# EAGLE design PartsHunter (EAGLE 9.5.2)
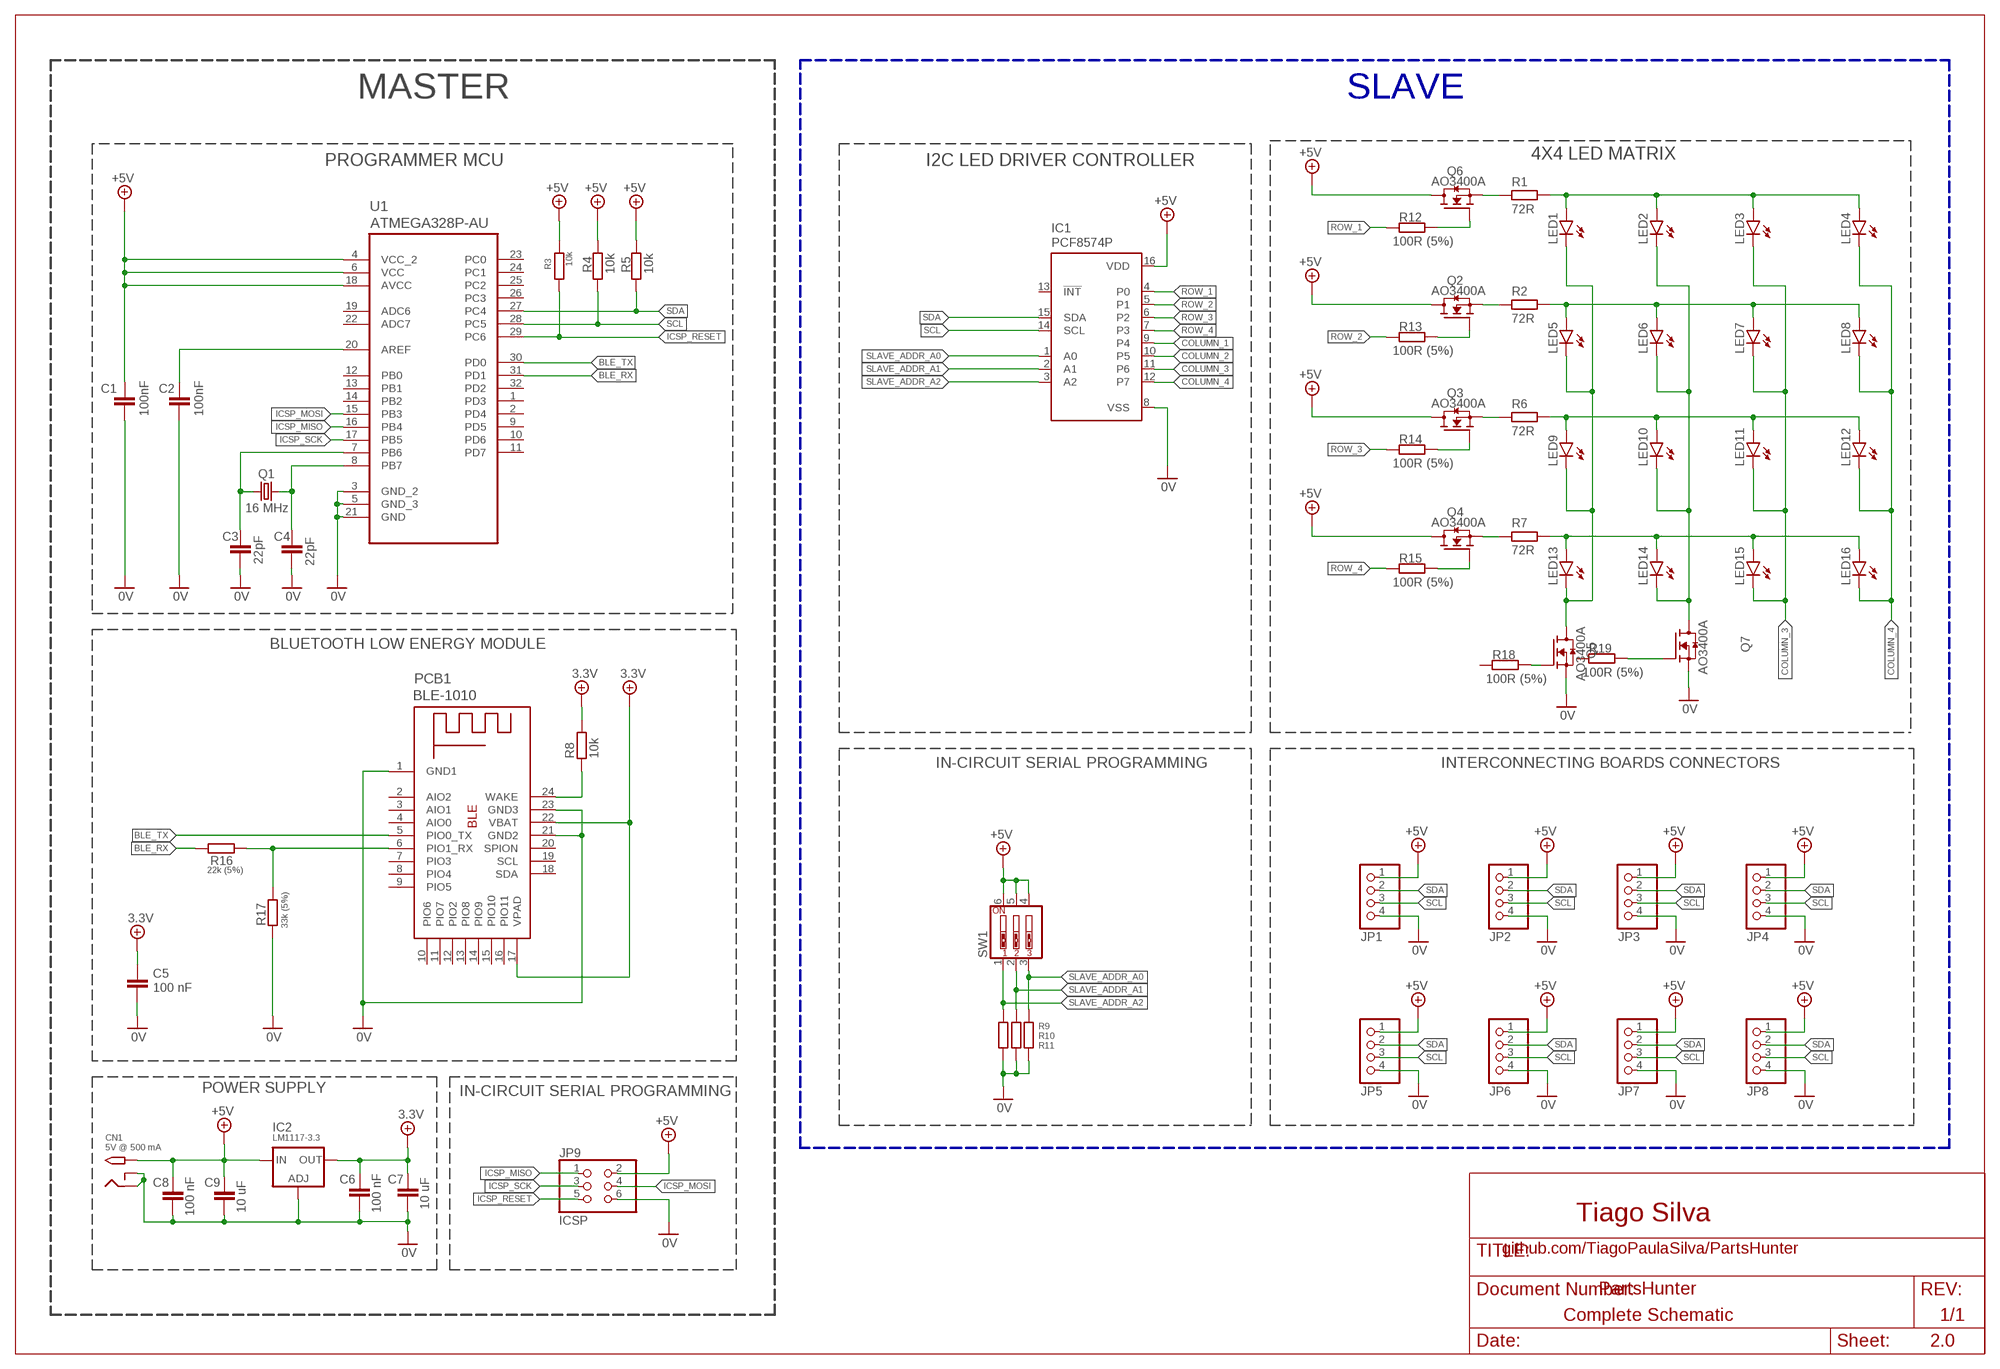
[diagram p0: schematic, sheet 1]

## Parts
C1  100nF  C-EUC0805  [C0805]
C2  100nF  C-EUC0805  [C0805]
C3  22pF  C-EUC0805  [C0805]
C4  22pF  C-EUC0805  [C0805]
C5  100 nF  C-EUC0805  [C0805]
C6  100 nF  C-EUC0805  [C0805]
C7  10 uF  C-EUC0805  [C0805]
C8  100 nF  C-EUC0805  [C0805]
C9  10 uF  C-EUC0805  [C0805]
CN1  2.1MMJACKTHM  [PJ-102A]
IC1  PCF8574P  [DIL16]
IC2  LM1117-3.3  LD117AS33TR  [SOT223]
JP1  PINHD-1X4/90  [1X04/90]
JP2  PINHD-1X4/90  [1X04/90]
JP3  PINHD-1X4/90  [1X04/90]
JP4  PINHD-1X4/90  [1X04/90]
JP5  PINHD-1X4/90  [1X04/90]
JP6  PINHD-1X4/90  [1X04/90]
JP7  PINHD-1X4/90  [1X04/90]
JP8  PINHD-1X4/90  [1X04/90]
JP9  ICSP  PINHD-2X3  [2X03]
LED1  LEDKA-3528ASYC  [KA-3528ASYC]
LED2  LEDKA-3528ASYC  [KA-3528ASYC]
LED3  LEDKA-3528ASYC  [KA-3528ASYC]
LED4  LEDKA-3528ASYC  [KA-3528ASYC]
LED5  LEDKA-3528ASYC  [KA-3528ASYC]
LED6  LEDKA-3528ASYC  [KA-3528ASYC]
LED7  LEDKA-3528ASYC  [KA-3528ASYC]
LED8  LEDKA-3528ASYC  [KA-3528ASYC]
LED9  LEDKA-3528ASYC  [KA-3528ASYC]
LED10  LEDKA-3528ASYC  [KA-3528ASYC]
LED11  LEDKA-3528ASYC  [KA-3528ASYC]
LED12  LEDKA-3528ASYC  [KA-3528ASYC]
LED13  LEDKA-3528ASYC  [KA-3528ASYC]
LED14  LEDKA-3528ASYC  [KA-3528ASYC]
LED15  LEDKA-3528ASYC  [KA-3528ASYC]
LED16  LEDKA-3528ASYC  [KA-3528ASYC]
PCB1  BLE-1010  [BLE-1010]
Q1  16 MHz  CRYSTALHC49UP  [HC49UP]
Q2  AO3400A  [SOT95P280X125-3N]
Q3  AO3400A  [SOT95P280X125-3N]
Q4  AO3400A  [SOT95P280X125-3N]
Q5  AO3400A  [SOT95P280X125-3N]
Q6  AO3400A  [SOT95P280X125-3N]
Q7  AO3400A  [SOT95P280X125-3N]
R1  72R  R-EU_R0805  [R0805]
R2  72R  R-EU_R0805  [R0805]
R3  10k  R-EU_R0805  [R0805]
R4  10k  R-EU_R0805  [R0805]
R5  10k  R-EU_R0805  [R0805]
R6  72R  R-EU_R0805  [R0805]
R7  72R  R-EU_R0805  [R0805]
R8  10k  R-EU_R0603  [R0603]
R9  10k  R-EU_R0805  [R0805]
R10  10k  R-EU_R0805  [R0805]
R11  10k  R-EU_R0805  [R0805]
R12  100R (5%)  R-EU_R0805  [R0805]
R13  100R (5%)  R-EU_R0805  [R0805]
R14  100R (5%)  R-EU_R0805  [R0805]
R15  100R (5%)  R-EU_R0805  [R0805]
R16  22k (5%)  R-EU_R0805  [R0805]
R17  33k (5%)  R-EU_R0805  [R0805]
R18  100R (5%)  R-EU_R0805  [R0805]
R19  100R (5%)  R-EU_R0805  [R0805]
SW1  SW_DIP-3  [EDG-03]
U1  ATMEGA328P-AU  [QFP80P900X900X120-32N]

## Nets
0V: C1.1 C2.1 C3.1 C4.1 C5.2 C6.2 C7.2 C8.2 C9.2 CN1.RING CN1.RING_SW IC1.8(VSS) IC2.1(ADJ) JP1.4 JP2.4 JP3.4 JP4.4 JP5.4 JP6.4 JP7.4 JP8.4 JP9.6 PCB1.1(GND1) PCB1.21(GND2) PCB1.23(GND3) Q5.2(S) Q7.2(S) R9.2 R10.2 R11.2 R17.1 U1.3(GND_2) U1.5(GND_3) U1.21(GND)
3.3V: C5.1 C6.1 C7.1 IC2.4(OUT) PCB1.17(VPAD) PCB1.22(VBAT) R8.1
+5V: C1.2 C8.1 C9.1 CN1.TIP IC1.16(VDD) IC2.3(IN) JP1.1 JP2.1 JP3.1 JP4.1 JP5.1 JP6.1 JP7.1 JP8.1 JP9.2 Q2.3(D) Q3.3(D) Q4.3(D) Q6.3(D) R3.1 R4.1 R5.1 SW1.4 SW1.5 SW1.6 U1.4(VCC_2) U1.6(VCC) U1.18(AVCC)
BLE_RX: R16.1 U1.31(PD1)
BLE_TX: PCB1.5(PIO0_TX) U1.30(PD0)
BLE_WAKE: PCB1.24(WAKE) R8.2
COLUMN_1: IC1.9(P4) LED1.C LED1.P$2(C) LED5.C LED5.P$2(C) LED9.C LED9.P$2(C) LED13.C LED13.P$2(C) Q5.3(D)
COLUMN_2: IC1.10(P5) LED2.C LED2.P$2(C) LED6.C LED6.P$2(C) LED10.C LED10.P$2(C) LED14.C LED14.P$2(C) Q7.3(D)
COLUMN_3: IC1.11(P6) LED3.C LED3.P$2(C) LED7.C LED7.P$2(C) LED11.C LED11.P$2(C) LED15.C LED15.P$2(C)
COLUMN_4: IC1.12(P7) LED4.C LED4.P$2(C) LED8.C LED8.P$2(C) LED12.C LED12.P$2(C) LED16.C LED16.P$2(C)
ICSP_MISO: JP9.1 U1.16(PB4)
ICSP_MOSI: JP9.4 U1.15(PB3)
ICSP_RESET: JP9.5 R3.2 U1.29(PC6)
ICSP_SCK: JP9.3 U1.17(PB5)
N$1: C3.2 Q1.1 U1.7(PB6)
N$2: C4.2 Q1.2 U1.8(PB7)
N$3: Q6.1(G) R12.2
N$4: Q6.2(S) R1.2
N$5: LED1.A LED1.P$1(A) LED2.A LED2.P$1(A) LED3.A LED3.P$1(A) LED4.A LED4.P$1(A) R1.1
N$6: LED5.A LED5.P$1(A) LED6.A LED6.P$1(A) LED7.A LED7.P$1(A) LED8.A LED8.P$1(A) R2.1
N$7: LED9.A LED9.P$1(A) LED10.A LED10.P$1(A) LED11.A LED11.P$1(A) LED12.A LED12.P$1(A) R6.1
N$8: LED13.A LED13.P$1(A) LED14.A LED14.P$1(A) LED15.A LED15.P$1(A) LED16.A LED16.P$1(A) R7.1
N$9: Q4.1(G) R15.2
N$10: Q2.2(S) R2.2
N$11: Q3.1(G) R14.2
N$12: Q3.2(S) R6.2
N$13: Q2.1(G) R13.2
N$14: Q4.2(S) R7.2
N$15: PCB1.6(PIO1_RX) R16.2 R17.2
N$16: Q5.1(G) R18.2
N$17: C2.2 U1.20(AREF)
N$18: Q7.1(G) R19.2
ROW_1: IC1.4(P0) R12.1
ROW_2: IC1.5(P1) R13.1
ROW_3: IC1.6(P2) R14.1
ROW_4: IC1.7(P3) R15.1
SCL: IC1.14(SCL) JP1.3 JP2.3 JP3.3 JP4.3 JP5.3 JP6.3 JP7.3 JP8.3 R4.2 U1.28(PC5)
SDA: IC1.15(SDA) JP1.2 JP2.2 JP3.2 JP4.2 JP5.2 JP6.2 JP7.2 JP8.2 R5.2 U1.27(PC4)
SLAVE_ADDR_A0: IC1.1(A0) R11.1 SW1.3
SLAVE_ADDR_A1: IC1.2(A1) R10.1 SW1.2
SLAVE_ADDR_A2: IC1.3(A2) R9.1 SW1.1
Unconnected: IC1.13(!INT) PCB1.2(AIO2) PCB1.3(AIO1) PCB1.4(AIO0) PCB1.7(PIO3) PCB1.8(PIO4) PCB1.9(PIO5) PCB1.10(PIO6) PCB1.11(PIO7) PCB1.12(PIO2) PCB1.13(PIO8) PCB1.14(PIO9) PCB1.15(PIO10) PCB1.16(PIO11) PCB1.18(SDA) PCB1.19(SCL) PCB1.20(SPION) R18.1 R19.1 U1.1(PD3) U1.2(PD4) U1.9(PD5) U1.10(PD6) U1.11(PD7) U1.12(PB0) U1.13(PB1) U1.14(PB2) U1.19(ADC6) U1.22(ADC7) U1.23(PC0) U1.24(PC1) U1.25(PC2) U1.26(PC3) U1.32(PD2)

## Notes on the sheet
- MASTER | SLAVE
- PROGRAMMER MCU | 4X4 LED MATRIX
- I2C LED DRIVER CONTROLLER
- BLUETOOTH LOW ENERGY MODULE
- IN-CIRCUIT SERIAL PROGRAMMING | INTERCONNECTING BOARDS CONNECTORS
- POWER SUPPLY | IN-CIRCUIT SERIAL PROGRAMMING
- 5V @ 500 mA
- Tiago Silva
- github.com/TiagoPaulaSilva/PartsHunter
- Complete Schematic
- 2.0

## Library data of the parts
C1-C9 = rcl:C-EU: CAPACITOR, European symbol; SPICEPREFIX: C
CN1 = adafruit:2.1MMJACK: 2.1mm x 5.5mm THM DC jack with internal switch. Digikey part #PJ-102A, 4UCON part #05537 2.1mm x 5.5mm SMT DC jack with internal switch. Digikey part #PJ-002A-SMT, 4UCON part #03267 By microbuilder.eu & adafruit.com
IC1 = micro-philips:PCF8574: I2C-Bus Remote 8-bit I/O expander http://www.semiconductors.philips.com/acrobat_download/datasheets/PCF8574_4.pdf; MPN: PCF8574PN; OC_FARNELL: 204020; OC_NEWARK: 11N8515
IC2 = v-reg:LD117A?*: Low drop fixed and adjustable positive voltage regulators 1 A Source: http://www.st.com/stonline/products/literature/ds/7194/ld1117axx.pdf
JP1-JP8 = pinhead:PINHD-1X4: PIN HEADER
JP9 = pinhead:PINHD-2X3: PIN HEADER
LED1-LED16 = led2:LED: LED OSRAM: - CHIPLED LG R971, LG N971, LY N971, LG Q971, LY Q971, LO R971, LY R971 LH N974, LH R974 LS Q976, LO Q976, LY Q976 LO Q996 - Hyper CHIPLED LW Q18S LB Q993, LB Q99A, LB R99A - SideLED LS A670, LO A670, LY A670, LG A670, LP A670 LB A673, LV A673, LT A673, LW A673 LH A674 LY A675 LS A676, LA A676, LO A676, LY A676, LW A676 LS A679, LY A679, LG A679 - Hyper Micro SIDELED® LS Y876, LA Y876, LO Y876, LY Y876 LT Y87S - SmartLED LW L88C, LW L88S LB L89C, LB L89S, LG L890 LS L89K, LO L89K, LY L89K LS L896, LA L896, LO L896, LY L896 - TOPLED LS T670, LO T670, LY T670, LG T670, LP T670 LSG T670, LSP T670, LSY T670, LOP T670, LYG T670 LG T671, LOG T671, LSG T671 LB T673, LV T673, LT T673, LW T673 LH T674 LS T676, LA T676, LO T676, LY T676, LB T676, LH T676, LSB T676, LW T676 LB T67C, LV T67C, LT T67C, LS T67K, LO T67K, LY T67K, LW E67C LS E67B, LA E67B, LO E67B, LY E67B, LB E67C, LV E67C, LT E67C LW T67C LS T679, LY T679, LG T679 LS T770, LO T770, LY T770, LG T770, LP T770 LB T773, LV T773, LT T773, LW T773 LH T774 LS E675, LA E675, LY E675, LS T675 LS T776, LA T776, LO T776, LY T776, LB T776 LHGB T686 LT T68C, LB T68C - Hyper Mini TOPLED® LB M676 - Mini TOPLED Santana® LG M470 LS M47K, LO M47K, LY M47K Source: http://www.osram.convergy.de LUXEON: - LUMILED® LXK2-PW12-R00, LXK2-PW12-S00, LXK2-PW14-U00, LXK2-PW14-V00 LXK2-PM12-R00, LXK2-PM12-S00, LXK2-PM14-U00 LXK2-PE12-Q00, LXK2-PE12-R00, LXK2-PE12-S00, LXK2-PE14-T00, LXK2-PE14-U00 LXK2-PB12-K00, LXK2-PB12-L00, LXK2-PB12-M00, LXK2-PB14-N00, LXK2-PB14-P00, LXK2-PB14-Q00 LXK2-PR12-L00, LXK2-PR12-M00, LXK2-PR14-Q00, LXK2-PR14-R00 LXK2-PD12-Q00, LXK2-PD12-R00, LXK2-PD12-S00 LXK2-PH12-R00, LXK2-PH12-S00 LXK2-PL12-P00, LXK2-PL12-Q00, LXK2-PL12-R00 Source: www.luxeon.com KINGBRIGHT: KA-3528ASYC Source: www.kingbright.com
PCB1 = BLE-1010:BLE-1010
Q1 = crystal:CRYSTAL: CRYSTAL; OC_FARNELL: unknown; OC_NEWARK: unknown
Q2-Q7 = AO3400A:AO3400A: Trans MOSFET N-CH 30V 5.7A 3-Pin SOT-23; AVAILABILITY: Unavailable; DESCRIPTION: N-Channel 30V 5.7A _Ta_ 1.4W _Ta_ Surface Mount SOT-23-3L; MF: Alpha &; MP: AO3400A; PACKAGE: SOT-23 Alpha &amp; Omega Semiconductor; PRICE: None
R1-R19 = rcl:R-EU_: RESISTOR, European symbol; SPICEPREFIX: R
SW1 = special:SW_DIP-3: DIP SWITCH
U1 = Atmel_By_element14_Batch_1-00:ATMEGA328P-AU: 8-bit Microcontroller with In-System Programmable Flash; MPN: ATMEGA328P-AU; OC_FARNELL: 1715486; OC_NEWARK: 14R4631; PACKAGE: TQFP-32; SUPPLIER: Atmel

## Net classes
2 gnd: width 0.152 mm, drill 0.559 mm, clearance 0.254 mm

## Board
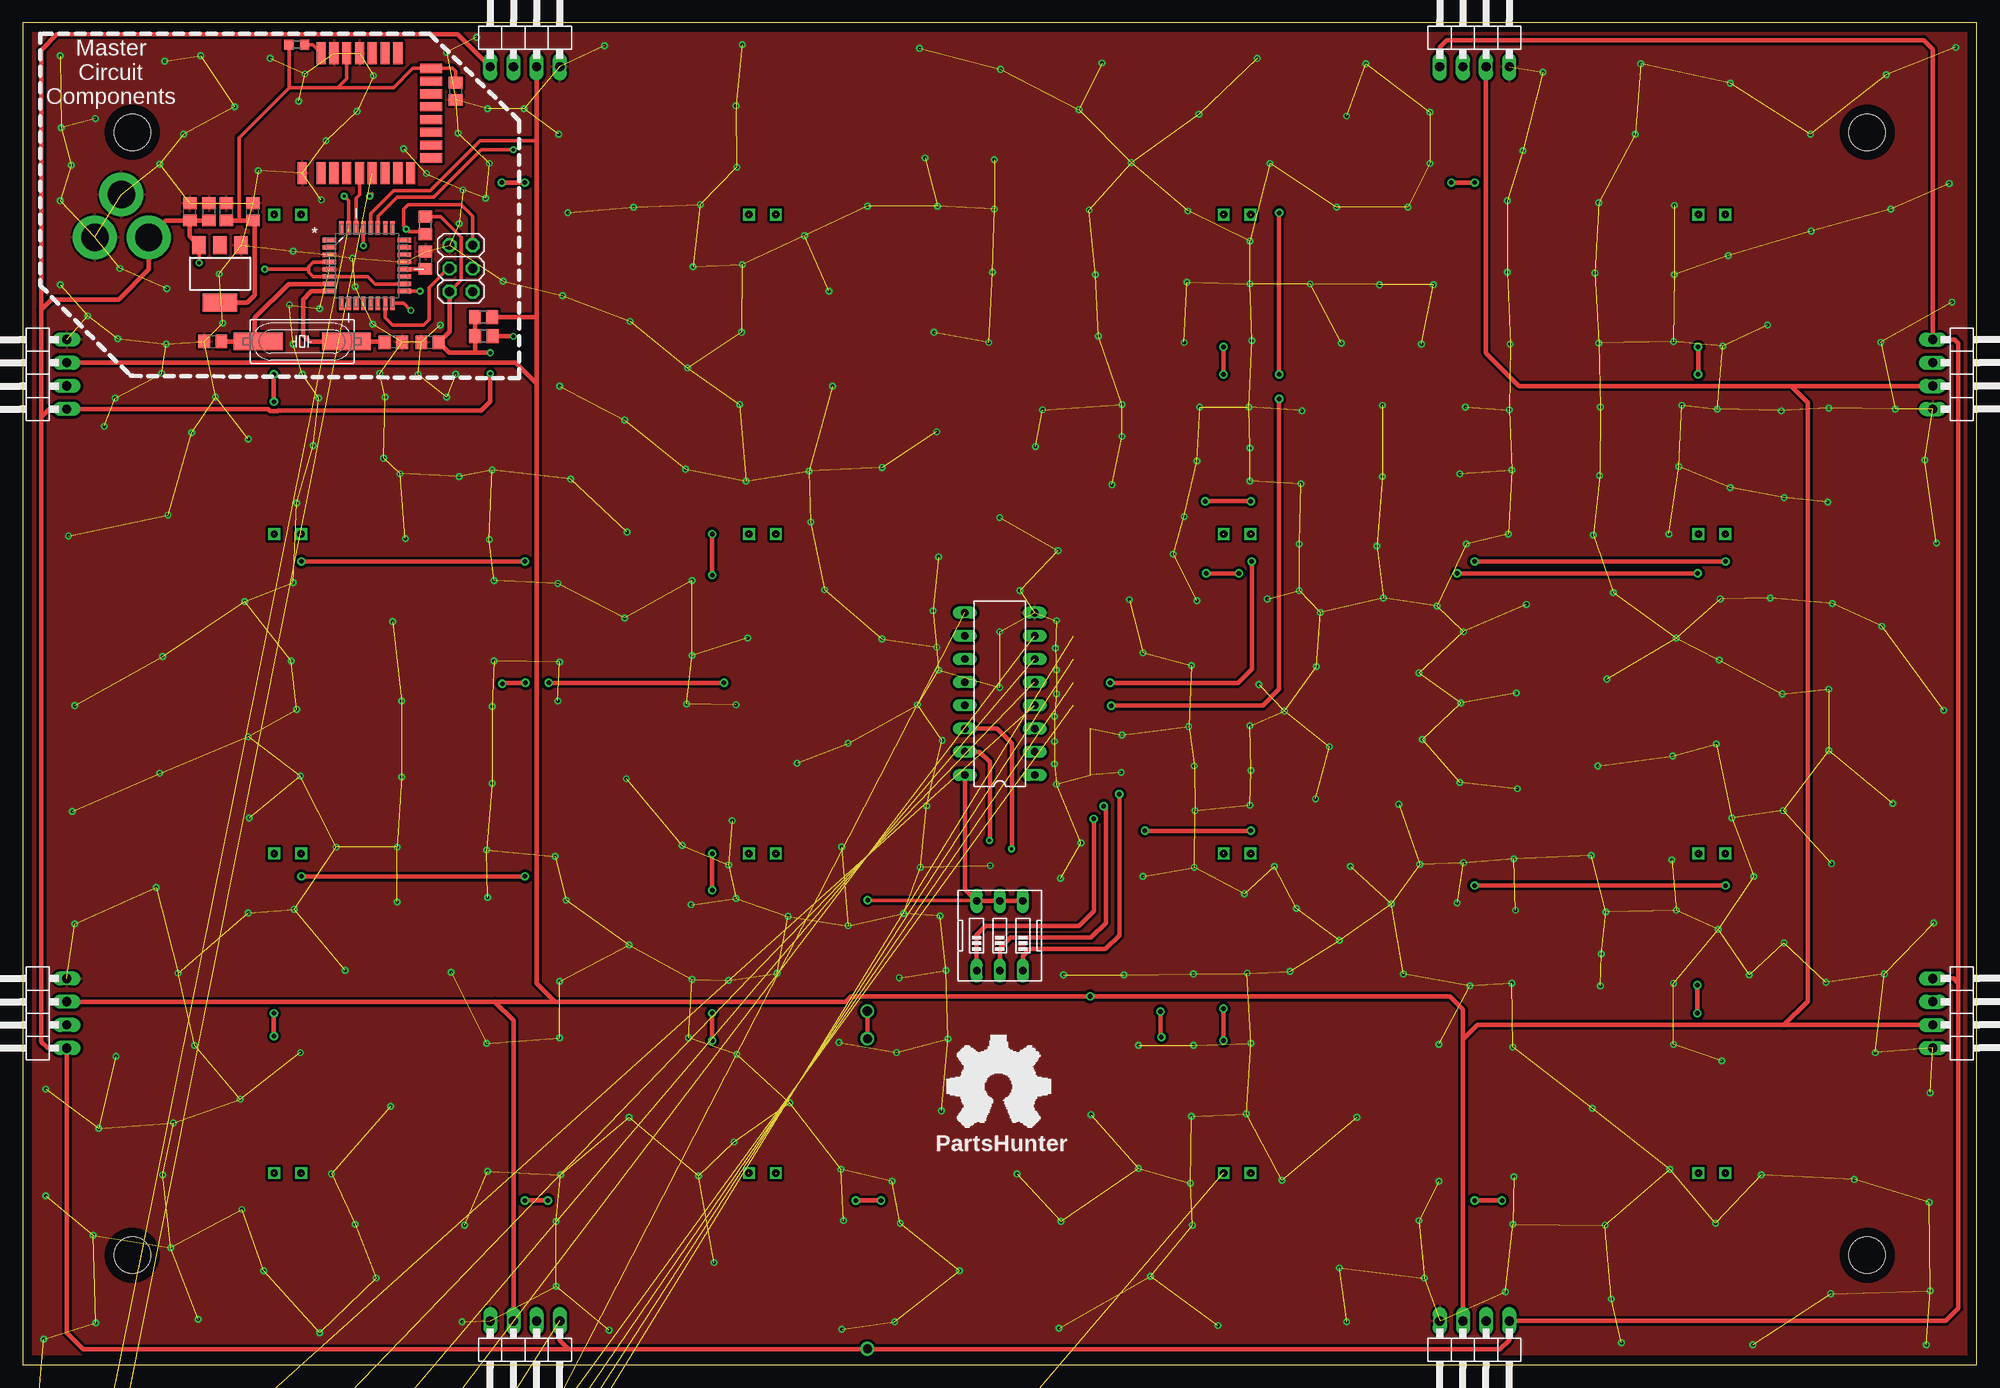
[diagram p1: board, top side]
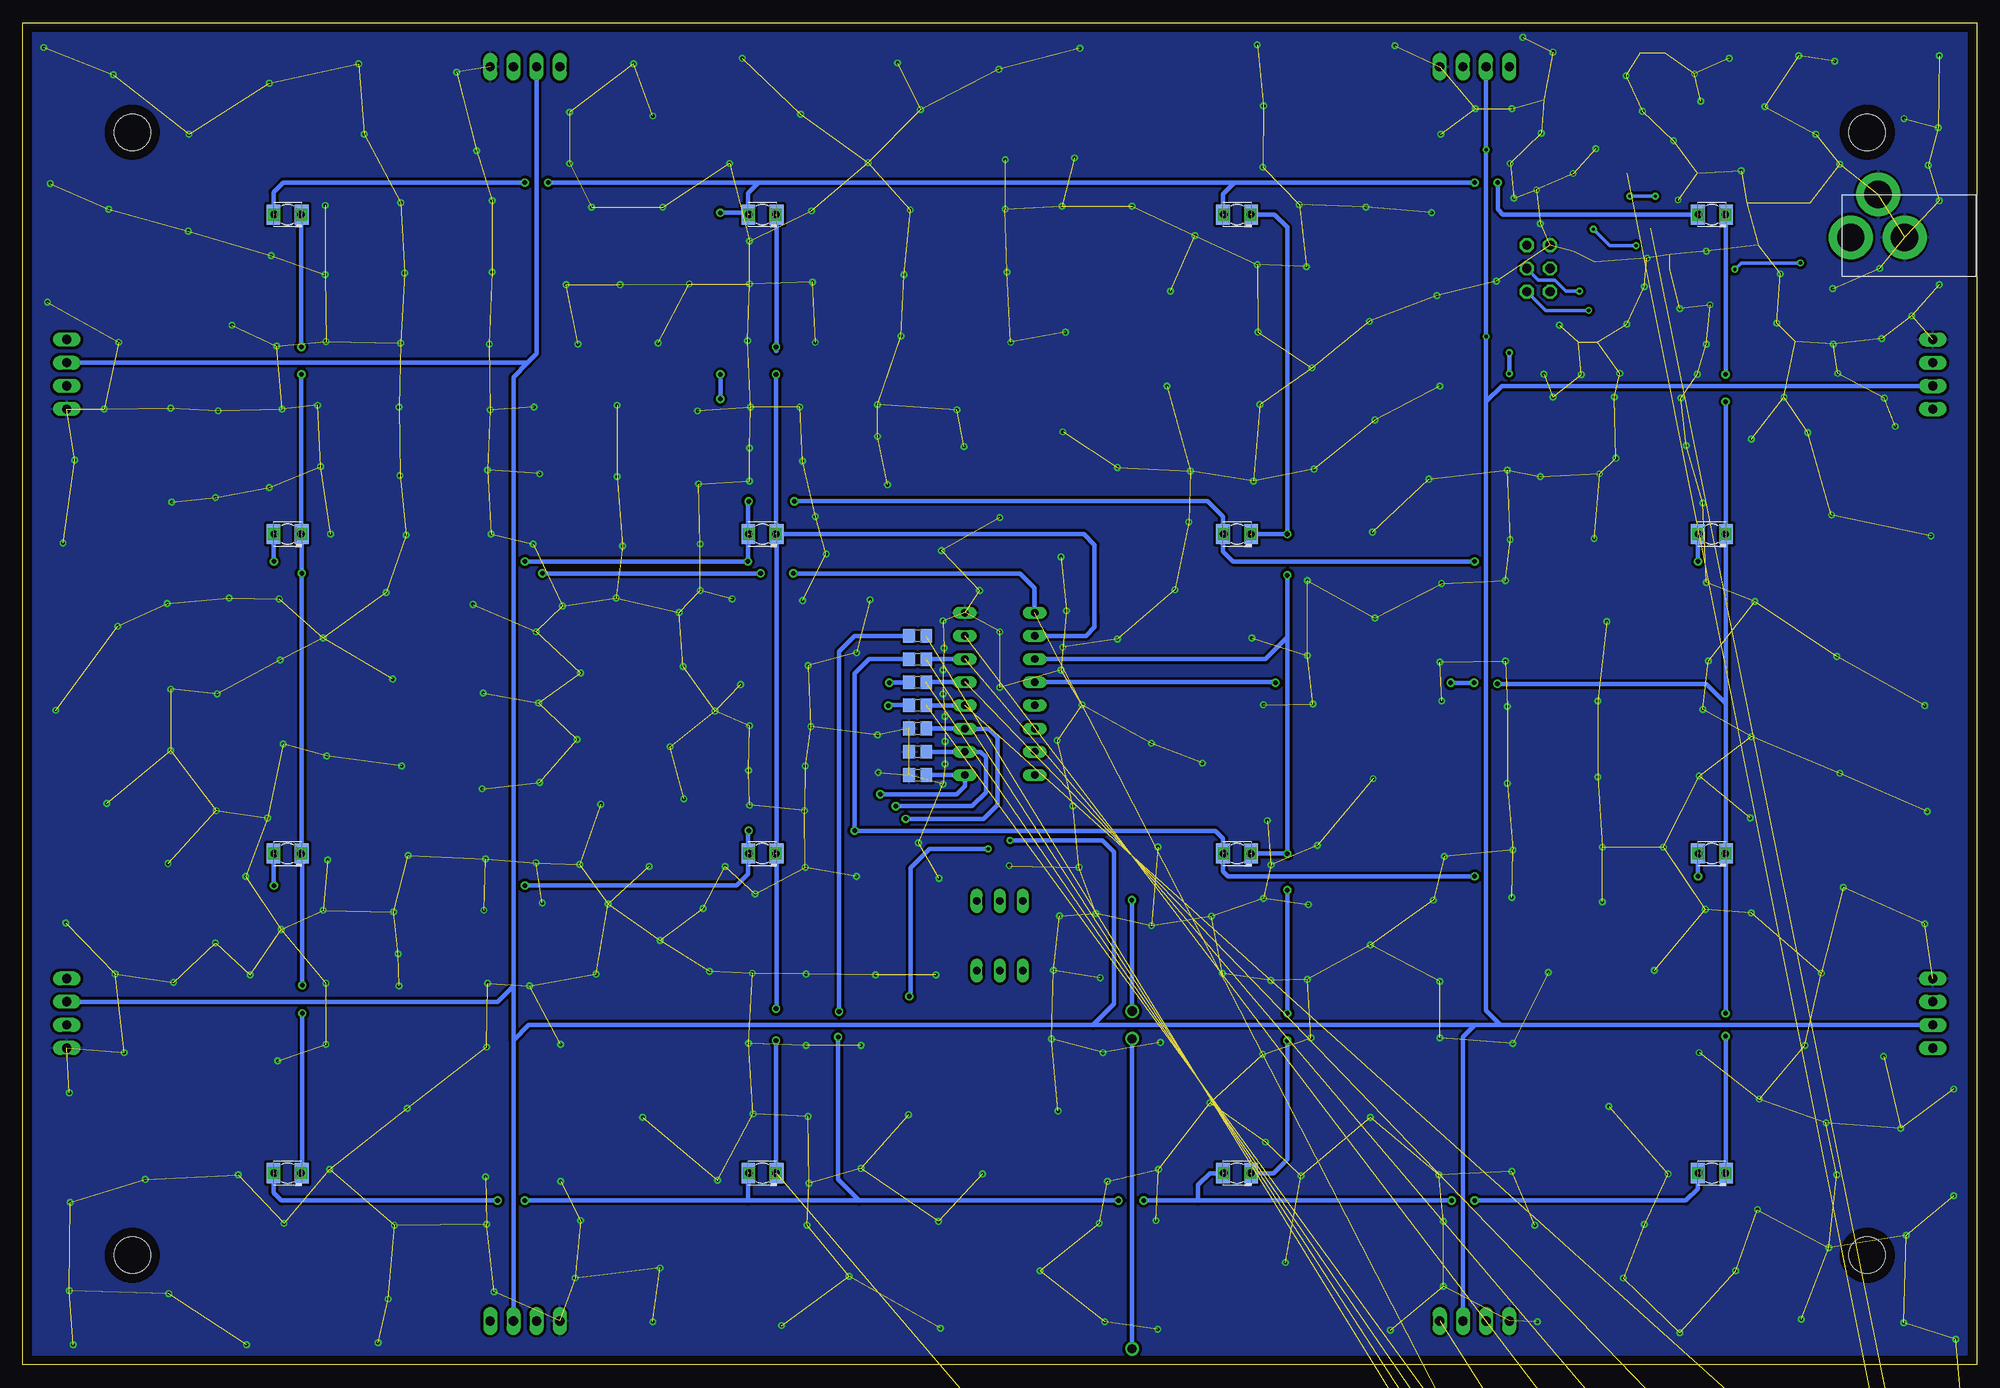
[diagram p2: board, bottom side, seen from below]

Size 214 x 147 mm. Coordinates in mm from the lower left corner, seen from the top.
Outline: 0,0 214,0 214,147 0,147 0,0
Copper layers (1*16): Top 0.035mm / dielectric 1.5mm / Bottom 0.035mm
Design rules "default *": minimum track width 15mil, minimum drill 0.35mm, track to track 12mil, track to pad 12mil, pad to pad 12mil, via to via 12mil, smd to smd 12mil, copper to edge 40mil, drill to drill 6mil, minimum pad ring 10mil, minimum via ring 8mil, stop-mask expansion 4mil, vias tented up to drill 0mil, thermal gap 10mil
Holes 4 mm at 12,135 202,135 12,12 202,12

### Footprints (pad centres in the part's own frame; a part is rotated, then mirrored left to right if it is on the bottom)
C0805 = smd 1.3 x 1.5: 1 -0.95,0; 2 0.95,0
PJ-102A = drill 3 pad 4.8: RING 0.1,-3.39; RING_SW -4.6,-6.29; TIP 0.1,-9.29
DIL16 = drill 0.813 long: 1 -8.89,-3.81; 2 -6.35,-3.81; 3 -3.81,-3.81; 4 -1.27,-3.81; 5 1.27,-3.81; 6 3.81,-3.81; 7 6.35,-3.81; 8 8.89,-3.81; 9 8.89,3.81; 10 6.35,3.81; 11 3.81,3.81; 12 1.27,3.81; 13 -1.27,3.81; 14 -3.81,3.81; 15 -6.35,3.81; 16 -8.89,3.81
SOT223 = smd 1.5 x 2: 1 -2.3,-3.15; 2 0,-3.15; 3 2.3,-3.15 | smd 3.8 x 2: 4 0,3.15
1X04/90 = drill 1.016 long: 1 -3.81,-3.81; 2 -1.27,-3.81; 3 1.27,-3.81; 4 3.81,-3.81
2X03 = drill 1.016 octagon: 1 -2.54,-1.27; 2 -2.54,1.27; 3 0,-1.27; 4 0,1.27; 5 2.54,-1.27; 6 2.54,1.27
KA-3528ASYC = smd 1.5 x 2.2: A -1.55,0; C 1.55,0 | drill 0.8 square: P$1 -1.47,0; P$2 1.47,0
BLE-1010 = smd 2.41 x 1: 1 -6.75,6.02; 2 -6.75,3.92; 3 -6.75,2.52; 4 -6.75,1.12; 5 -6.75,-0.28; 6 -6.75,-1.68; 7 -6.75,-3.08; 8 -6.75,-4.48; 9 -6.75,-5.88; 18 6.35,-4.48; 19 6.35,-3.08; 20 6.35,-1.68; 21 6.35,-0.28; 22 6.35,1.12; 23 6.35,2.52; 24 6.35,3.92 | smd 1 x 2.41: 10 -5.1,-8.1; 11 -3.7,-8.1; 12 -2.3,-8.1; 13 -0.9,-8.1; 14 0.5,-8.1; 15 1.9,-8.1; 16 3.3,-8.1; 17 4.7,-8.1
HC49UP = smd 5.334 x 1.93: 1 -4.826,0; 2 4.826,0
SOT95P280X125-3N = smd 1.21 x 0.59: 1 -1.255,0.95; 2 -1.255,-0.95; 3 1.255,0
R0805 = smd 1.3 x 1.5: 1 -0.95,0; 2 0.95,0
R0603 = smd 1 x 1.1: 1 -0.85,0; 2 0.85,0
EDG-03 = drill 0.813 long: 1 -2.54,-3.81; 2 0,-3.81; 3 2.54,-3.81; 4 2.54,3.81; 5 0,3.81; 6 -2.54,3.81
QFP80P900X900X120-32N = smd 1.473 x 0.508: 1 -4.115,2.794; 2 -4.115,2.007; 3 -4.115,1.194; 4 -4.115,0.406; 5 -4.115,-0.406; 6 -4.115,-1.194; 7 -4.115,-2.007; 8 -4.115,-2.794; 17 4.115,-2.794; 18 4.115,-2.007; 19 4.115,-1.194; 20 4.115,-0.406; 21 4.115,0.406; 22 4.115,1.194; 23 4.115,2.007; 24 4.115,2.794 | smd 0.508 x 1.473: 9 -2.794,-4.115; 10 -2.007,-4.115; 11 -1.194,-4.115; 12 -0.406,-4.115; 13 0.406,-4.115; 14 1.194,-4.115; 15 2.007,-4.115; 16 2.794,-4.115; 25 2.794,4.115; 26 2.007,4.115; 27 1.194,4.115; 28 0.406,4.115; 29 -0.406,4.115; 30 -1.194,4.115; 31 -2.007,4.115; 32 -2.794,4.115

### Placement (x,y rotation side)
C1  44.6,112 0 top
C2  44.1,121 270 top
C3  20.8,112.1 0 top
C4  40.6,112 180 top
C5  47.4,139.5 270 top
C6  25.2,126.3 90 top
C7  22.3,126.3 90 top
C8  20.4,126.3 90 top
C9  18.3,126.3 90 top
CN1  4.5,123.6 270 bottom
IC1  107,73.5 90 top
IC2  21.6,119.5 180 top
JP1  55,1 180 top
JP2  1,108.5 90 top
JP3  159,1 180 top
JP4  213,108.5 270 top
JP5  55,146 0 top
JP6  1,38.5 90 top
JP7  213,38.5 270 top
JP8  159,146 0 top
JP9  48,120.1 90 top
LED1  185,126 0 bottom
LED2  133,126 0 bottom
LED3  81,126 0 bottom
LED4  29,126 0 bottom
LED5  185,91 0 bottom
LED6  133,91 0 bottom
LED7  81,91 0 bottom
LED8  29,91 0 bottom
LED9  185,56 0 bottom
LED10  133,56 0 bottom
LED11  81,56 0 bottom
LED12  29,56 0 bottom
LED13  185,21 0 bottom
LED14  133,21 0 bottom
LED15  81,21 0 bottom
LED16  29,21 0 bottom
PCB1  36.6,137.3 90 top
Q1  30.6,112.1 0 top
Q2  -3.96,-99.64 0 top  (outside the outline)
Q3  -3.96,-107.24 0 top  (outside the outline)
Q4  -3.96,-114.83 0 top  (outside the outline)
Q5  -3.96,-122.43 0 top  (outside the outline)
Q6  -3.96,-92.05 0 top  (outside the outline)
Q7  -3.96,-136.17 0 top  (outside the outline)
R1  116,72.25 0 bottom
R2  116,74.75 0 bottom
R3  44.1,124.8 270 top
R4  50.46,114.77 0 top
R5  50.5,112.68 0 top
R6  116,77.3 0 bottom
R7  116,79.85 0 bottom
R8  30,144.6 0 top
R9  116,69.7 180 bottom
R10  116,67.15 180 bottom
R11  116,64.6 180 bottom
R12  -4.34,-32.18 0 top  (outside the outline)
R13  -4.34,-45.75 0 top  (outside the outline)
R14  -4.34,-59.31 0 top  (outside the outline)
R15  -4.34,-72.87 0 top  (outside the outline)
R16  -4.47,-79.02 0 top  (outside the outline)
R17  -4.47,-85.17 0 top  (outside the outline)
R18  -4.47,-129.29 0 top  (outside the outline)
R19  -4.47,-143.03 0 top  (outside the outline)
SW1  107,47 0 top
U1  37.7,120.4 0 top

### Tracks (layer width: path | path; a pad name or v marks a point on that pad's centre or on a via)
0V  (via drill 0.35)  (493 unrouted)
  other vias: 15.7,111.8 52.6,118.7 58.7,134.8 78.2,131.2 78.8,144.6 63.7,144.5 78.1,137.9 98.2,144.2 98.8,132.2 107.1,141.9 106.4,132 121.4,131.7 136.6,131.6 154.1,131.6 154.1,137.2 147.1,142.5 135.2,143.1 118.2,142.6 115.7,137.5 128.8,137 145,136.8 134.4,123.1 134.4,118.4 134.6,112.2 141,118.4 148.6,118.3 154.5,118.3 151.7,126.8 143.9,126.8 144.4,111.9 153.2,111.8 127.2,112 127.5,118.6 127.6,126.4 116.8,126.5 106.4,126.6 106.2,119.7 105.8,112 117.8,112.7 117.5,119.4 100.2,126.9 92.5,126.9 85.6,123.7 78.8,120.5 78.7,113.1 78.5,105.2 79.2,96.8 86.1,97.9 94.1,98.3 100.1,102.2 99.8,113.1 88.3,117.6 88.7,107.2 59.7,126.2 74.2,127.1 66.9,126.8 59.1,117.1 58.8,107.2 66.5,114.3 73.4,120.3 72.8,109.2 72.6,98.1 66.2,91.2 60,97 65.9,103.5 31.8,100.7 30,94.4 41.9,90.5 51.1,90.4 51.4,98 47.8,97.3 39.5,99.3 41.3,97.6 24.7,101.4 8.9,102.8 5,90.8 18.5,102.1 15.9,93.1 24.3,83.6 15.3,77.6 5.7,72.2 5.4,60.6 15,64.8 24.7,68.8 24.8,59.9 24.7,49.5 17,42.9 5.7,48.3 14.6,52.3 30,71.8 41.5,72.7 51.4,72.1 51.4,63.7 41.5,64.4 30.4,64.5 34.3,56.7 41,56.7 50.8,56.4 50.9,51.2 41,50.7 29.7,49.9 35.3,43.2 46.9,43 59.5,50.9 73.2,50.4 66.4,46 58.8,42 73.3,42.2 78.1,51.1 89.69,56.73 90.4,48.1 83.82,49.13 77.3,42.1 82.59,42.86 96.45,49.46 101.1,43.2 96,42.4 100.45,49.18 2.5,30.2 2.5,18.5 2.3,2.8 8,4.6 7.7,14.2 8.3,25.9 10.2,33.8 18.8,35 23.8,29.1 16.5,26.5 15.3,20.8 24,17 16.2,12.8 19.2,5 26.4,10.3 36.4,15.4 32.5,3.5 38.7,9.5 48.4,15.3 48.1,4.7 50.9,21.2 33.8,20.9 30.4,34.2 50.8,35.2 40.3,28.3 58.8,35.8 58.9,20.8 66.4,27.1 72.9,35.8 74,20.7 84,28.7 78.2,34 77.9,24.4 89.6,21.4 89.4,35.3 66.1,64.2 58.6,72.7 72.7,72.4 72.2,56.9 58.3,55.7 78.1,72.3 77.7,59.6 84.8,65.9 98,72.3 99,61.2 58.8,77 58.6,85.6 65.9,81.8 73.3,85.9 73.3,77.7 29.6,85.7 29.4,77.1 51.6,77.1 40.5,81.4 51.6,85.9 94.1,79.5 79.4,79.6 87.8,84.9 86.3,92.3 107,92.8 127.2,92.9 58.4,15.7 58.4,8.6 75.7,11.2 89.9,15.8 89.7,3.9 64.2,3.8 95.2,20.1 95.7,34.2 101.33,35.69 122.2,35 122.2,21.5 108.9,20.9 117,27.4 100.6,27.8 128.2,35 127.9,19.9 128,27.2 134.5,35.2 134,27.5 137.9,20.2 146.1,27.1 155.1,35.1 155.1,20.1 96.1,15.5 113.7,15.7 128.1,15.3 152.9,15.8 153.5,9.5 145,4.7 130.9,4.3 113.5,4 95.5,4.7 123.5,9.7 102.6,10.3 144.2,10.6 162.4,8 163.2,15.4 185.4,15.5 190.4,20.8 186.1,33.3 202.9,34.2 208.9,29.8 208.8,17.8 208.9,8.1 198,7.8 174,7.2 173.3,15.3 200.6,20.3 163.3,20.6 163.2,34.8 171.9,28.1 180.8,35.1 180.4,21.4 208.5,2.2 189.5,2.2 175.1,2.4 128.2,42.8 120.6,42.7 114,42.7 122.7,53.5 128.3,54.5 133.8,51.6 134.1,42.9 144.2,46.5 157.1,50.6 158.5,41.5 151.2,42.8 149.9,50.5 139.5,50 138.8,43.1 120.3,64.9 120.4,69 127.7,69.9 128.3,65.6 128.4,60.7 134.4,61.3 134.5,65.1 134.4,70 135.4,74.5 138.2,71.6 137.1,54.6 145.4,54.6 153,54.8 157.8,55 157.4,63.8 157.5,72.5 157.8,80.3 141.6,62 150.7,61.4 143.1,67.7 153.3,68.5 141.7,76.5 152.9,75.8 142.1,82.4 154.9,83.1 149,84 128,76.6 128.6,83.7 121.2,83.8 109.2,84.8 107,80.3 107,74.2 99.7,82.6 100.3,88.5 113.4,89.2 126,88.8 115.92,57.17 98.3,54.5 105.96,54.67 113.67,53.29 136.3,83.9 139.8,84.8 139.8,89.9 148.3,89.7 158.1,89.9 140,96.5 140.1,104.5 148.9,105.1 148.9,97.3 158,104.9 157.4,97.6 134.4,96.8 134.4,100.4 134.3,104.9 110.9,100.6 111.7,104.6 120.4,105.2 128.9,104.9 128.6,99 119.3,96.4 120.4,101.7 162.9,111.8 172.6,111.9 180.8,112.1 180.9,119.4 180.9,127 172.6,127.3 162.6,127.5 162.6,119.7 172.2,119.6 162.8,104.6 172.8,104.9 181.7,105.1 181.4,98.4 180.3,91 172,90.9 172.7,97.4 163.1,98 162.7,91 163.1,41.8 163.5,49.8 173.4,49.6 172.9,45 172.8,41.5 180.8,41.8 181.1,49.8 163.3,55.4 171.8,55.8 180.6,55.3 180.7,66.7 172.5,65.6 163.7,63.1 163.6,73.6 173.5,75.1 181.1,79.6 164.7,83.3 174.2,84.6 185.9,83.9 191.4,84 185.8,77.2 185.5,68 187.2,59.9 189.6,53.5 185.7,47.7 189.1,42.7 192.9,46.2 192.8,60.7 192.7,73.5 192.9,95 187,96.1 185.6,104.7 192.6,104.5 197.8,104.8 205.1,104.7 197.7,94.5 198.2,83.4 197.8,74 197.8,67.3 198.1,54.9 197.5,41.9 203.9,42.8 209.3,48.4 204.8,61.5 210.4,71.7 203.6,80.9 209.6,90 208.3,99.1 186.2,111.6 186.8,121.5 191.1,113.9 195.9,124.2 203.5,112 211.3,116.4 211,129.4 211.7,144.3 204.1,141.3 204.6,126.6 164.3,133 166.5,141.6 176.6,134.8 177.2,142.5 187,140.4 195.8,134.8 45.7,113.9 38.3,114 36.1,121.2 36.4,118.1 32.5,115.7 29.6,111.8 29.2,116.1 29.6,122 32.7,127.6 21.9,114.1 47.4,108.5 30.6,108.5 43.29,108.49 48.2,128.7 51.1,131.6 50.7,127.8 44.2,130.5 47.7,134.9 50.9,137.6 54.9,137.6 46.4,143.8 49.7,145.4 38.4,141.2 30.9,141.4 30.2,138.4 36.6,137.3 33.2,134.1 41.7,133.2 27.1,143.1 23.2,137.8 25.8,130.8 15,131.5 4.1,143.4 4.2,135.5 4.1,127.5 15.52,142.8 19.5,143.4 7.96,136.52 17.6,134.8 5.3,131.4 21.5,119.5 4.1,118.3 10.6,120.1 7.1,114.9 15.78,117.89 10.4,112.4 10.1,105.9 21.1,106 15.2,108.6 32.4,105.9 46.4,106 39.7,106 39.1,108.6 122.7,78 113,71 113,68.3 113,65.8 113.2,63.6 113.2,73.5 113.2,76.1 113.1,78.5 113.2,81.5 100.3,76.1 100.1,78.6 100.7,68.4 90.39,68.09 47.8,125 77.28,54.74
  pour Top: 0,0 214,0 214,147 0,147
  pour Bottom: 0,0 0,147 214,147 214,0 0.1,0
3.3V
  Top 0.406: 34.5,139.9 40.6,139.9 42.7,142 PCB1.17 47.1,142 47.4,141.7 C5.1 | PCB1.22 35.48,140.88 34.5,139.9 | 23.7,125.35 23.7,134.4 29.2,139.9 | 29.2,139.9 34.5,139.9 | R8.1 29.2,144.55 29.2,139.9
  Top 0.508: IC2.4 24.6,116.35 25.41,117.16 25.41,125.35 C6.1 23.7,125.35 C7.1
+5V  (via drill 0.35, 0.5, 1)  (4 unrouted)
  Top 0.381: v19.3,120.7 IC2.3 | 31.3,120 v26.5,120 | 31.3,120.3 31.3,120 | 31.3,120 31.3,119.9
  Top 0.406: U1.18 38.61,118.39 37.79,119.21 U1.6 31.79,119.21 31.3,119.7 31.3,119.9 | U1.4 31.81,120.81 31.3,120.3 | JP9.2 48,118.83 48,123.5 45.75,125.75 R3.1 | 10.55,116.75 10.5,116.7 | SW1.6 104.38,50.89 v92.53,50.89
  Top 0.508: 2,103.8 2,35.4 2.71,34.69 JP6.1 4.81,3.5 6.62,1.69 59.8,1.69 | 92.5,1.69 59.8,1.69 | v92.5,1.77 92.5,1.69 | SW1.4 SW1.5 SW1.6 103.19,52.08 IC1.16 | v92.49,38.74 v92.5,38.74 v92.5,35.72 | JP1.1 58.81,2.68 59.8,1.69 | 92.5,1.69 161.8,1.69 162.81,2.7 JP3.1 210.6,4.81 212,6.21 212,41.8 | JP7.1 211.49,42.31 212,41.8 | 212,41.8 212,111.91 211.6,112.31 JP4.1 209.19,144.12 208.2,145.11 156,145.11 155.19,144.3 JP8.1 | 2,103.8 2.89,104.69 JP2.1 26.88,104.69 27.08,104.49 27.92,104.49 27.93,104.5 50.2,104.5 51.2,105.5 v51.2,108.57 | C9.1 C8.1 | C9.1 15.64,125.35 CN1.TIP 13.79,119.99 10.55,116.75 | IC2.3 18.3,123.65 C9.1 | JP5.1 47.65,145.73 3.73,145.73 2,144 2,115.6 | 10.5,116.7 3.1,116.7 2,115.6 | 2,115.6 2,103.8 | JP9.2 46.73,113.18 C1.2 46.69,110.86 49.53,110.86 | v51.2,110.86 49.53,110.86 | R4.1 49.55,114.72 R5.1 49.55,110.88 49.53,110.86
  Bottom 0.381: v26.5,120 25.8,120.7 v19.3,120.7
  Bottom 0.508: v92.5,1.77 v92.5,35.72 | v92.53,50.89 92.52,50.88 92.52,38.77 v92.49,38.74 | v51.2,110.86 v51.2,108.57
BLE_RX  (via drill 0.35)  (1 unrouted)
  Top 0.406: U1.31 35.69,127.49 35.7,127.5 v35.2,128 | v37.99,128 38.28,128.29
  Bottom 0.406: v35.2,128 v37.99,128
BLE_TX
  Top 0.406: U1.30 36.51,127.81 36.9,128.2 36.9,130.53 PCB1.5
BLE_WAKE
  Top 0.406: R8.2 31.73,144.6 PCB1.24
COLUMN_1  (via drill 0.5)  (5 unrouted)
  Top 0.508: v183.5,111.5 v183.5,108.5 | v157.1,86.7 v183.45,86.7 | v129.6,86.7 v133.2,86.7 | v183.4,38.5 v183.4,41.6
  Bottom 0.508: v183.5,108.5 183.5,91 LED5.C v183.45,86.7 LED9.C 183.4,55.95 v183.4,41.6 | v183.4,38.5 183.4,21.05 LED13.C | IC1.9 103.19,85.1 104.79,86.7 v129.6,86.7 | v133.2,86.7 133.48,86.7 133.48,86.68 157.1,86.68 v157.1,86.7 | v183.5,111.5 183.5,125.95 LED1.C
COLUMN_2  (via drill 0.5)  (5 unrouted)
  Top 0.508: v131.5,111.5 v131.5,108.5 | v131.5,39 v131.5,35.5
  Bottom 0.508: LED2.C 131.45,111.04 131.5,111.04 v131.5,111.5 | v131.5,108.5 131.5,91 LED6.C | LED6.C LED10.C 131.45,39 v131.5,39 | v131.5,35.5 131.5,21 LED14.C | LED6.C 97.8,91 96.6,89.8 96.6,82.1 96.6,80.8 97.55,79.85 IC1.10
COLUMN_3  (via drill 0.5)  (4 unrouted)
  Top 0.508: v75.5,91 v75.5,86.5 | v75.5,56 v75.5,52 | v75.5,38.5 v75.5,35.5
  Bottom 0.508: LED3.C 76.9,126 75.5,124.6 v75.5,91 LED7.C | v75.5,86.5 75.5,79.71 | 75.5,79.71 v75.5,56 LED11.C | v75.5,52 v75.5,38.5 | v75.5,35.5 75.5,22.5 77,21 LED15.C | IC1.11 77.9,77.31 75.5,79.71
COLUMN_4  (via drill 0.5)  (4 unrouted)
  Top 0.508: v27.5,105.5 v27.5,108.5 | v76.8,74.7 v57.6,74.7 | v55.05,74.7 52.5,74.7 v52.5,74.6 | v27.5,38.5 v27.5,36
  Bottom 0.508: 27.45,72.45 LED12.C 27.45,38.5 v27.5,38.5 | v27.5,108.5 27.5,126 LED4.C | v27.5,105.5 27.5,91 LED8.C 27.45,72.45 | IC1.12 76.8,74.77 v76.8,74.7 | v57.6,74.7 v55.05,74.7 | 27.45,72.45 29.6,74.6 v52.5,74.6 | v27.5,36 27.5,21.05 LED16.C
ICSP_MISO  (via drill 0.35)
  Top 0.406: U1.16 41.72,116.28 v42.5,115.5
  Bottom 0.406: v42.5,115.5 47.21,115.5 JP9.1
ICSP_MOSI
  Top 0.406: U1.15 39.71,114.69 40.5,113.9 43.9,113.9 44.5,114.5 44.5,118 46.6,120.1 JP9.4
ICSP_RESET  (via drill 0.35)
  Top 0.406: JP9.5 49.27,125.83 48,127.1 42.2,127.1 41.7,126.6 41.7,124.7 v42,124.4 42.3,124.1 43.85,124.1 R3.2 | U1.29 v37.29,122.61 v37.3,122.6
  Bottom 0.406: v37.3,122.6 40.2,122.6 v42,124.4
ICSP_SCK  (via drill 0.35)
  Top 0.406: v43.5,117.6 U1.17
  Bottom 0.406: JP9.3 48,118.83 46.2,118.83 44.97,117.6 v43.5,117.6
N$1
  Top 0.508: C3.2 25.4,112.1 | 25.4,112.1 Q1.1 | U1.7 29.09,118.39 25.4,114.7 25.4,112.1
N$2
  Top 0.508: C4.2 39.55,112.1 Q1.2 31.4,112.1 30.7,112.8 30.7,116.7 31.61,117.61 U1.8
N$3  (1 unrouted)
N$4  (1 unrouted)
N$5  (via drill 0.5)  (4 unrouted)
  Top 0.508: v52.46,129.5 v55,129.5 | v156.46,129.5 v159,129.5 | v119.2,72.2 135.8,72.2 137.6,74 v137.6,105.8 | v137.6,108.5 v137.6,126.2
  Bottom 0.508: v55,129.5 81.3,129.5 | 81.3,129.5 133.4,129.5 | 133.4,129.5 v156.46,129.5 | v159,129.5 185.5,129.5 186.55,128.45 LED1.A | R1.1 119.2,72.25 v119.2,72.2 | v137.6,105.8 v137.6,108.5 | v137.6,126.2 134.5,126.2 134.5,126 LED2.A 134.55,128.35 133.4,129.5 | 81.3,129.5 82.55,128.25 LED3.A | LED4.A 51.9,126 52.46,126.56 v52.46,129.5
N$6  (via drill 0.5)  (4 unrouted)
  Top 0.508: v186.5,88 v159,88 | v30.5,88 v55,88 | v119.1,74.7 133.1,74.7 134.6,76.2 v134.6,88 | v129.5,94.6 v134.5,94.6
  Bottom 0.508: v159,88 v134.6,88 134.55,88 LED6.A 134.55,94.6 v134.5,94.6 | LED5.A 186.55,88 v186.5,88 | LED8.A 30.55,88 v30.5,88 | R2.1 119.1,74.75 v119.1,74.7 | v129.5,94.6 84.25,94.6 82.55,92.9 LED7.A 82.55,89.1 81.45,88 v55,88
N$7  (via drill 0.5)  (4 unrouted)
  Top 0.508: v186.5,52.5 v159,52.5 | v30.5,53.5 v55,53.5 | v122.9,58.5 v134.5,58.5
  Bottom 0.508: LED9.A 186.55,52.5 v186.5,52.5 | LED12.A 30.55,53.5 v30.5,53.5 | v134.5,58.5 134.55,58.5 LED10.A 134.55,53.75 135.8,52.5 v159,52.5 | R6.1 121.3,77.3 122.9,75.7 v122.9,58.5 83.4,58.5 82.55,57.65 LED11.A 82.55,54.05 82,53.5 v55,53.5
N$8  (via drill 0.5)  (4 unrouted)
  Top 0.508: v91.23,18 v94,18 | v159,18 v162,18 | v124.6,38.7 124.6,35.9 v124.7,35.9 | v55,18 v57.5,18
  Bottom 0.508: v94,18 122.4,18 | 122.4,18 134.55,18 | 134.55,18 LED14.A | 134.55,18 v159,18 | R7.1 122.9,79.85 124.6,78.15 v124.6,38.7 | v124.7,35.9 124.7,20.3 122.4,18 | LED16.A 30.55,19.3 31.85,18 v55,18 | v162,18 185.7,18 186.55,18.85 LED13.A | v57.5,18 85.3,18 | 85.3,18 v91.23,18 | LED15.A 84,21 85.3,19.7 85.3,18
N$9  (1 unrouted)
N$10  (1 unrouted)
N$11  (1 unrouted)
N$12  (1 unrouted)
N$13  (1 unrouted)
N$14  (1 unrouted)
N$15  (2 unrouted)
N$16  (1 unrouted)
N$17
  Top 0.508: U1.20 44.04,119.99 C2.2
N$18  (1 unrouted)
ROW_1  (1 unrouted)
  Bottom 0.508: IC1.4 115.05,72.23
ROW_2  (1 unrouted)
  Bottom 0.508: IC1.5 115.05,74.77
ROW_3  (1 unrouted)
  Bottom 0.508: IC1.6 115.05,77.31
ROW_4  (1 unrouted)
SCL  (via drill 0.35, 0.5)
  Top 0.406: U1.28 38.11,126.11 40.6,128.6 44.6,128.6 50.1,134.1 56.27,134.1
  Top 0.508: JP5.3 56.27,134.1 56.27,114.68 | 56.27,114.68 56.27,107.5 | JP2.3 54,109.77 56.27,107.5 | 56.27,107.5 56.27,41.8 58.3,39.77 | JP6.3 51.7,39.77 | 51.7,39.77 58.3,39.77 | JP1.3 53.73,37.74 51.7,39.77 | 58.3,39.77 90.1,39.77 90.69,40.36 v116.9,40.36 156.3,40.36 157.73,38.93 157.73,35.66 | 157.73,35.66 JP3.3 | JP7.3 192.9,37.23 | 192.9,37.23 159.3,37.23 157.73,35.66 | JP4.3 193.67,107.23 | 193.67,107.23 163.88,107.23 160.27,110.84 JP8.3 | IC1.14 106.7,69.69 108.33,68.06 108.33,56.52 108.33,56.51 v108.27,56.51 | 193.67,107.23 195.5,105.4 195.5,39.83 192.9,37.23 | R4.2 56.19,114.77 56.27,114.68
  Bottom 0.508: v116.9,40.36 116.8,40.36 116.8,54.41 114.7,56.51 v108.27,56.51
SDA  (via drill 0.35)
  Top 0.406: U1.27 38.89,125.79 40.99,127.89 44.99,127.89 50.2,133.1 v53.73,133.1
  Top 0.508: IC1.15 104.8,67.15 105.92,66.03 105.92,57.4 105.89,57.4 v105.86,57.43 | R5.2 53.69,112.68 v53.72,112.65 v53.73,112.65
  Bottom 0.508: JP5.2 v53.73,133.1 v53.73,112.65 53.73,105.5 | JP2.2 52,107.23 53.73,105.5 | 53.73,105.5 53.73,38.8 52.16,37.23 | 54.94,37.23 52.16,37.23 | 52.16,37.23 JP6.2 | JP1.2 56.27,35.9 54.94,37.23 | 54.94,37.23 96.79,37.23 | 96.79,37.23 158.6,37.23 160.27,35.56 | 160.27,35.56 JP3.2 | 160.27,35.56 160.27,41.5 | JP7.2 162,39.77 160.27,41.5 | 160.27,41.5 160.27,108.2 158.7,109.77 | 158.7,109.77 JP4.2 | JP8.2 157.73,110.74 158.7,109.77 | v105.86,57.43 95.77,57.43 94.51,56.17 94.51,39.51 96.79,37.23
SLAVE_ADDR_A0  (via drill 0.5)
  Top 0.508: v120.1,62.5 120.1,47.03 118.6,45.53 110.3,45.53 109.54,44.77 SW1.3
  Bottom 0.508: R11.1 IC1.1 110.81,63.4 111.71,62.5 v120.1,62.5
SLAVE_ADDR_A1  (via drill 0.5)
  Top 0.508: SW1.2 107,45.6 108.2,46.8 117,46.8 118.62,48.42 118.62,61.12 118.4,61.12 v118.4,61.2
  Bottom 0.508: R10.1 IC1.2 110.81,67.13 109.1,67.13 108.52,66.56 108.52,62.7 110.02,61.2 v118.4,61.2
SLAVE_ADDR_A2  (via drill 0.5)
  Top 0.508: SW1.1 104.46,47.1 105.46,48.1 115.7,48.1 117.3,49.7 v117.3,59.8
  Bottom 0.508: R9.1 IC1.3 110.81,69.67 108.2,69.67 107.25,68.73 107.25,61.3 108.75,59.8 v117.3,59.8

### Text on the board
tPlace: Master / Circuit / Components | PartsHunter